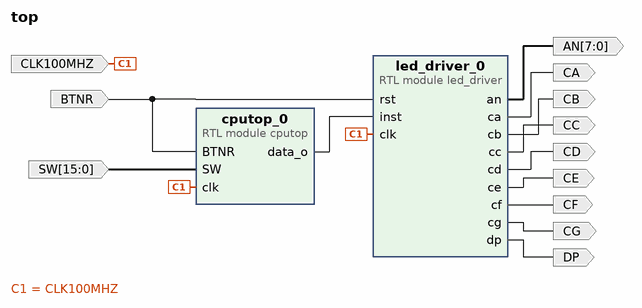
[diagram p0: block diagram of the top level]
# Vivado block design top, xc7a100tcsg324-1, Vivado 2024.1.1
create_bd_design top

create_bd_port -dir I -type clk CLK100MHZ
set_property -dict {CONFIG.FREQ_HZ 100000000} [get_bd_ports CLK100MHZ]
create_bd_port -dir I BTNR
create_bd_port -dir I -from 15 -to 0 SW
create_bd_port -dir O -from 7 -to 0 AN
create_bd_port -dir O CA
create_bd_port -dir O CB
create_bd_port -dir O CC
create_bd_port -dir O CD
create_bd_port -dir O CE
create_bd_port -dir O CF
create_bd_port -dir O CG
create_bd_port -dir O DP

create_bd_cell -type module -reference led_driver led_driver_0
create_bd_cell -type module -reference cputop cputop_0

# ---- connections ----

connect_bd_net [get_bd_ports BTNR] [get_bd_pins led_driver_0/rst] [get_bd_pins cputop_0/BTNR]
connect_bd_net [get_bd_ports CLK100MHZ] [get_bd_pins led_driver_0/clk] [get_bd_pins cputop_0/clk]
connect_bd_net [get_bd_ports SW] [get_bd_pins cputop_0/SW]
connect_bd_net [get_bd_pins cputop_0/data_o] [get_bd_pins led_driver_0/inst]
connect_bd_net [get_bd_pins led_driver_0/an] [get_bd_ports AN]
connect_bd_net [get_bd_pins led_driver_0/ca] [get_bd_ports CA]
connect_bd_net [get_bd_pins led_driver_0/cb] [get_bd_ports CB]
connect_bd_net [get_bd_pins led_driver_0/cc] [get_bd_ports CC]
connect_bd_net [get_bd_pins led_driver_0/cd] [get_bd_ports CD]
connect_bd_net [get_bd_pins led_driver_0/ce] [get_bd_ports CE]
connect_bd_net [get_bd_pins led_driver_0/cf] [get_bd_ports CF]
connect_bd_net [get_bd_pins led_driver_0/cg] [get_bd_ports CG]
connect_bd_net [get_bd_pins led_driver_0/dp] [get_bd_ports DP]

validate_bd_design
save_bd_design
